# Altium schematic sheet FPC_CAP_Water_Level.schdoc
size 278 x 195 mm
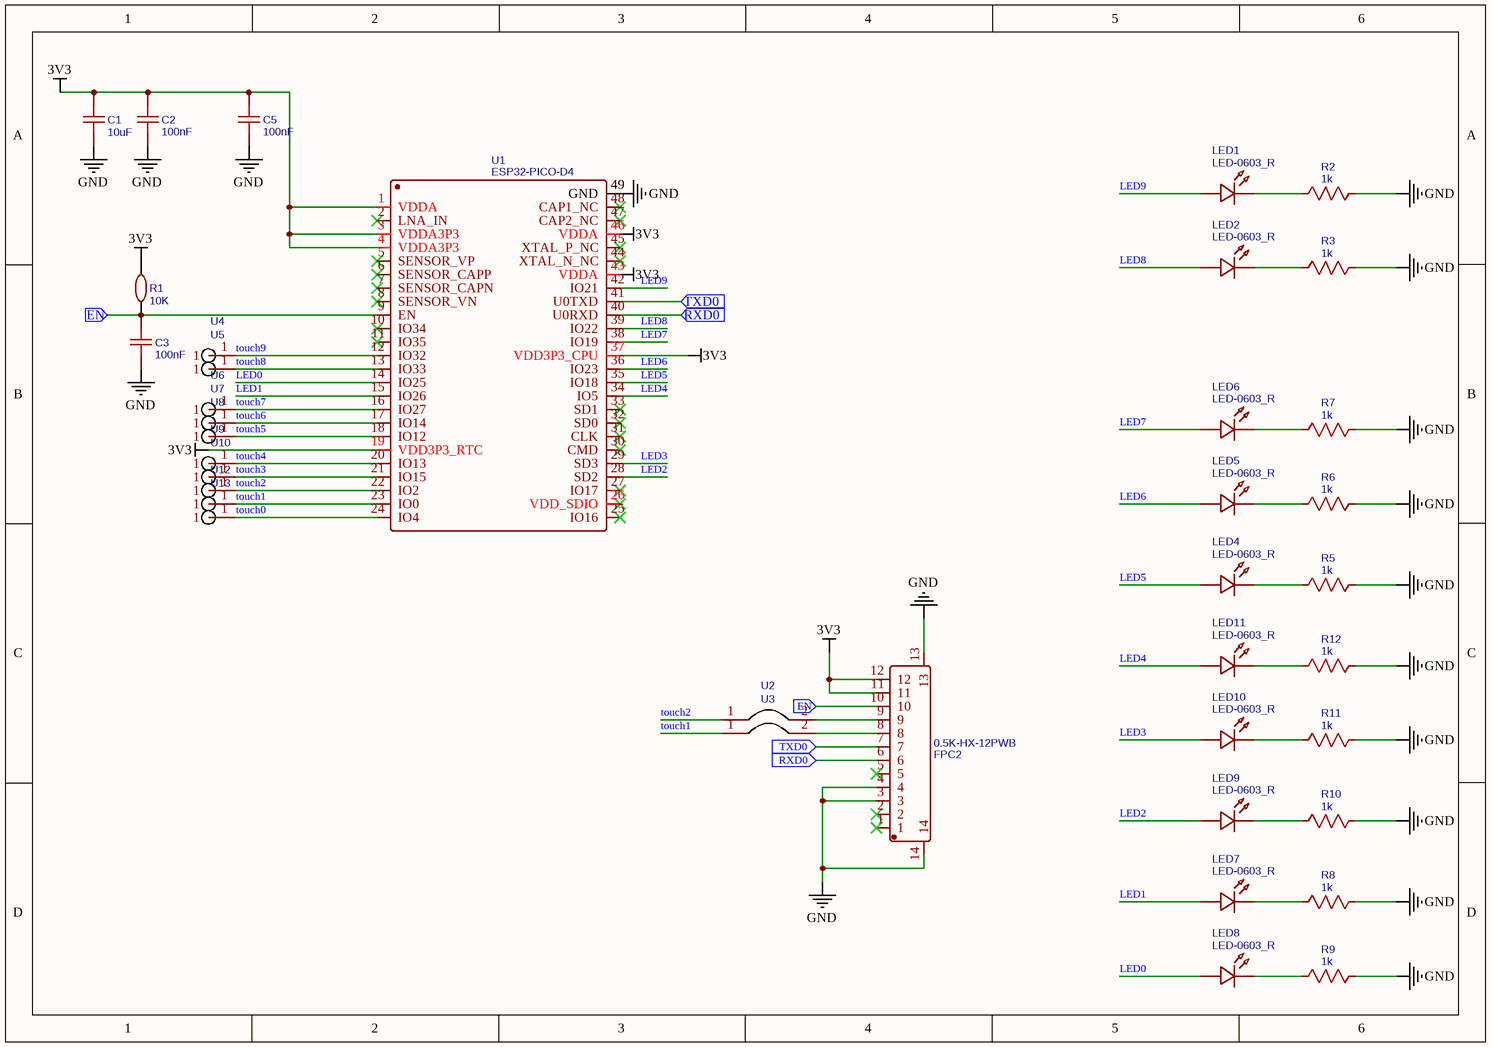
[diagram p0: FPC_CAP_Water_Level.schdoc]

## Parts
C1  10uF  [C0603]
C2  100nF  [C0603]
C3  100nF  [C0603]
C5  100nF  [C0603]
FPC2  0.5K-HX-12PWB  [FPC-SMD_12P-P0.50_HDGC_0.5K-HX-12PWB]
LED1  LED-0603_R  [LED0603_RED]
LED2  LED-0603_R  [LED0603_RED]
LED4  LED-0603_R  [LED0603_RED]
LED5  LED-0603_R  [LED0603_RED]
LED6  LED-0603_R  [LED0603_RED]
LED7  LED-0603_R  [LED0603_RED]
LED8  LED-0603_R  [LED0603_RED]
LED9  LED-0603_R  [LED0603_RED]
LED10  LED-0603_R  [LED0603_RED]
LED11  LED-0603_R  [LED0603_RED]
R1  10K  [R0603]
R2  1k  [R0603]
R3  1k  [R0603]
R5  1k  [R0603]
R6  1k  [R0603]
R7  1k  [R0603]
R8  1k  [R0603]
R9  1k  [R0603]
R10  1k  [R0603]
R11  1k  [R0603]
R12  1k  [R0603]
U1  ESP32-PICO-D4  [ESP32 PICO]
U2  短路点 0603  [短路点]  (value not drawn)
U3  短路点 0603  [短路点]  (value not drawn)
U4  测试点  [测试点]  (value not drawn)
U5  测试点  [测试点]  (value not drawn)
U6  测试点  [测试点]  (value not drawn)
U7  测试点  [测试点]  (value not drawn)
U8  测试点  [测试点]  (value not drawn)
U9  测试点  [测试点]  (value not drawn)
U10  测试点  [测试点]  (value not drawn)
U11  测试点  [测试点]  (value not drawn)
U12  测试点  [测试点]  (value not drawn)
U13  测试点  [测试点]  (value not drawn)

## Ports
EN (in), RXD0 (in), TXD0 (in)

## Nets
3V3: C1.2 C2.2 C5.2 FPC2.11 FPC2.12 R1.2 U1.1(VDDA) U1.3(VDDA3P3) U1.4(VDDA3P3) U1.19(VDD3P3_RTC) U1.37(VDD3P3_CPU) U1.43(VDDA) U1.46(VDDA)
GND: C1.1 C2.1 C3.1 C5.1 FPC2.3 FPC2.4 FPC2.13 FPC2.14 R2.2 R3.2 R5.2 R6.2 R7.2 R8.2 R9.2 R10.2 R11.2 R12.2 U1.49(GND)
EN: C3.2 FPC2.10 R1.1 U1.9(EN) ; port EN
LED0: LED8.1 U1.14(IO25)
LED1: LED7.1 U1.15(IO26)
LED2: LED9.1 U1.28(SD2)
LED3: LED10.1 U1.29(SD3)
LED4: LED11.1 U1.34(IO5)
LED5: LED4.1 U1.35(IO18)
LED6: LED5.1 U1.36(IO23)
LED7: LED6.1 U1.38(IO19)
LED8: LED2.1 U1.39(IO22)
LED9: LED1.1 U1.42(IO21)
RXD0: FPC2.6 U1.40(U0RXD) ; port RXD0
touch0: U1.24(IO4) U13.1
touch1: U1.23(IO0) U3.1 U12.1
touch2: U1.22(IO2) U2.1 U11.1
touch3: U1.21(IO15) U10.1
touch4: U1.20(IO13) U9.1
touch5: U1.18(IO12) U8.1
touch6: U1.17(IO14) U7.1
touch7: U1.16(IO27) U6.1
touch8: U1.13(IO33) U5.1
touch9: U1.12(IO32) U4.1
TXD0: FPC2.7 U1.41(U0TXD) ; port TXD0
NetFPC2_8: FPC2.8 U3.2
NetFPC2_9: FPC2.9 U2.2
NetLED1_2: LED1.2 R2.1
NetLED2_2: LED2.2 R3.1
NetLED4_2: LED4.2 R5.1
NetLED5_2: LED5.2 R6.1
NetLED6_2: LED6.2 R7.1
NetLED7_2: LED7.2 R8.1
NetLED8_2: LED8.2 R9.1
NetLED9_2: LED9.2 R10.1
NetLED10_2: LED10.2 R11.1
NetLED11_2: LED11.2 R12.1

Not connected (* = marked no-connect by the designer): FPC2 1* 2* 5*; U1 2(LNA_IN)* 5(SENSOR_VP)* 6(SENSOR_CAPP)* 7(SENSOR_CAPN)* 8(SENSOR_VN)* 10(IO34)* 11(IO35)* 25(IO16)* 26(VDD_SDIO)* 27(IO17)* 30(CMD)* 31(CLK)* 32(SD0)* 33(SD1)* 44(XTAL_N_NC)* 45(XTAL_P_NC)* 47(CAP2_NC)* 48(CAP1_NC)*

## Library data of the parts
C1 = 10uF: Manufacturer: SAMSUNG; Manufacturer Part: CL10A106MP8NNNC; nameAlias: Capacitance; Supplier: LCSC; Supplier Part: C85713; JLCPCB Part Class: Extended Part; spicePre: C; spiceSymbolName: CL10A106MP8NNNC
C2 C3 C5 = 100nF: Manufacturer: SAMSUNG; Manufacturer Part: CL10B104KB8NNNC; nameAlias: Capacitance; Supplier: LCSC; Supplier Part: C1591; JLCPCB Part Class: Extended Part; spicePre: C; spiceSymbolName: CL10B104KB8NNNC
FPC2 = 0.5K-HX-12PWB: Manufacturer: HDGC(华德共创); Contributor: LCSC; Supplier: LCSC; Supplier Part: C2919494; Manufacturer Part: 0.5K-HX-12PWB; JLCPCB Part Class: Extended Part; spicePre: F; spiceSymbolName: 0.5K-HX-12PWB
LED1 LED2 LED4-LED11 = LED-0603_R: Manufacturer: EVERLIGHT(台湾亿光); Manufacturer Part: 19-217/R6C-AL1M2VY/3T; Contributor: LCEDA_01; Supplier Part: C72044; Supplier: LCSC; spicePre: L; spiceSymbolName: LED-0603_R
R1 = 10K: Manufacturer: UniOhm; Manufacturer Part: 0603WAF1002T5E; nameAlias: Resistance (Ohms); Supplier: LCSC; Supplier Part: C25804; JLCPCB Part Class: Basic Part; spicePre: R; spiceSymbolName: 0603WAF1002T5E
R2 R3 R5-R12 = 1k: nameAlias: Value(Ω); Contributor: LCEDA_Lib; spicePre: R; spiceSymbolName: R_0603_US
U1 = ESP32-PICO-D4: Manufacturer: Espressif Systems; Contributor: LCSC; Supplier: LCSC; Supplier Part: C193707; Manufacturer Part: ESP32-PICO-D4; JLCPCB Part Class: Extended Part; spicePre: U; spiceSymbolName: ESP32-PICO-D4
U2 U3 = 短路点 0603: Contributor: CYIIOT; spicePre: U; spiceSymbolName: 短路点 0603
U4-U13 = 测试点: Contributor: cnweix; spicePre: U; spiceSymbolName: 测试点